# Vivado block design design_1, xczu28dr-ffvg1517-2-e, Vivado 2019.1
# (continued, part 2 of 3)
current_bd_instance /dac_block0_tile1/soft_reset

# ---- hierarchy /dac_block0_tile1/control_switch1 ----
current_bd_instance /dac_block0_tile1/control_switch1
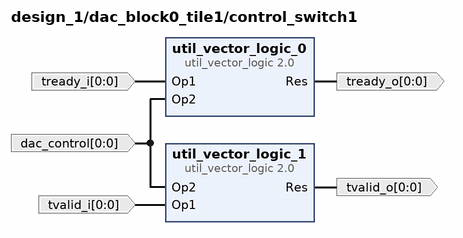
[diagram p18: block diagram inside /dac_block0_tile1/control_switch1]
create_bd_pin -dir I -from 0 -to 0 tready_i
create_bd_pin -dir I -from 0 -to 0 tvalid_i
create_bd_pin -dir O -from 0 -to 0 tready_o
create_bd_pin -dir O -from 0 -to 0 tvalid_o
create_bd_pin -dir I -from 0 -to 0 dac_control

create_bd_cell -type ip -vlnv xilinx.com:ip:util_vector_logic:2.0 util_vector_logic_0
set_property -dict {CONFIG.C_SIZE 1} [get_bd_cells util_vector_logic_0]
create_bd_cell -type ip -vlnv xilinx.com:ip:util_vector_logic:2.0 util_vector_logic_1
set_property -dict {CONFIG.C_SIZE 1} [get_bd_cells util_vector_logic_1]

# ---- hierarchy /dac_block0_tile1/control_localstart ----
current_bd_instance /dac_block0_tile1/control_localstart
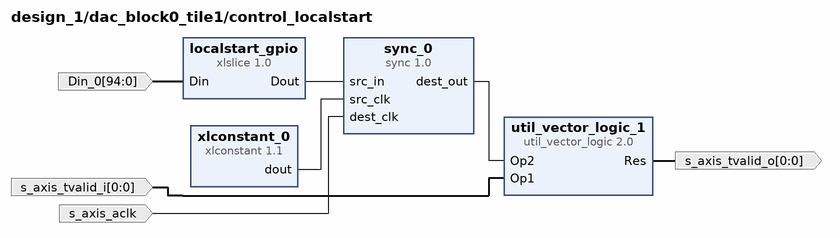
[diagram p19: block diagram inside /dac_block0_tile1/control_localstart]
create_bd_pin -dir I -from 0 -to 0 s_axis_tvalid_i
create_bd_pin -dir O -from 0 -to 0 s_axis_tvalid_o
create_bd_pin -dir I -from 94 -to 0 Din_0
create_bd_pin -dir I -type clk s_axis_aclk

create_bd_cell -type ip -vlnv xilinx.com:ip:util_vector_logic:2.0 util_vector_logic_1
set_property -dict {CONFIG.C_SIZE 1} [get_bd_cells util_vector_logic_1]
create_bd_cell -type ip -vlnv xilinx.com:ip:xlslice:1.0 localstart_gpio
set_property -dict {CONFIG.DIN_FROM 20 CONFIG.DIN_TO 20 CONFIG.DIN_WIDTH 95 CONFIG.DOUT_WIDTH 1} [get_bd_cells localstart_gpio]
create_bd_cell -type ip -vlnv xilinx.com:user:sync:1.0 sync_0
set_property -dict {CONFIG.DEST_SYNC_FF 2 CONFIG.SRC_INPUT_REG 0} [get_bd_cells sync_0]
create_bd_cell -type ip -vlnv xilinx.com:ip:xlconstant:1.1 xlconstant_0
set_property -dict {CONFIG.CONST_VAL 0} [get_bd_cells xlconstant_0]

# ---- hierarchy /ch_div_block ----
current_bd_instance /ch_div_block
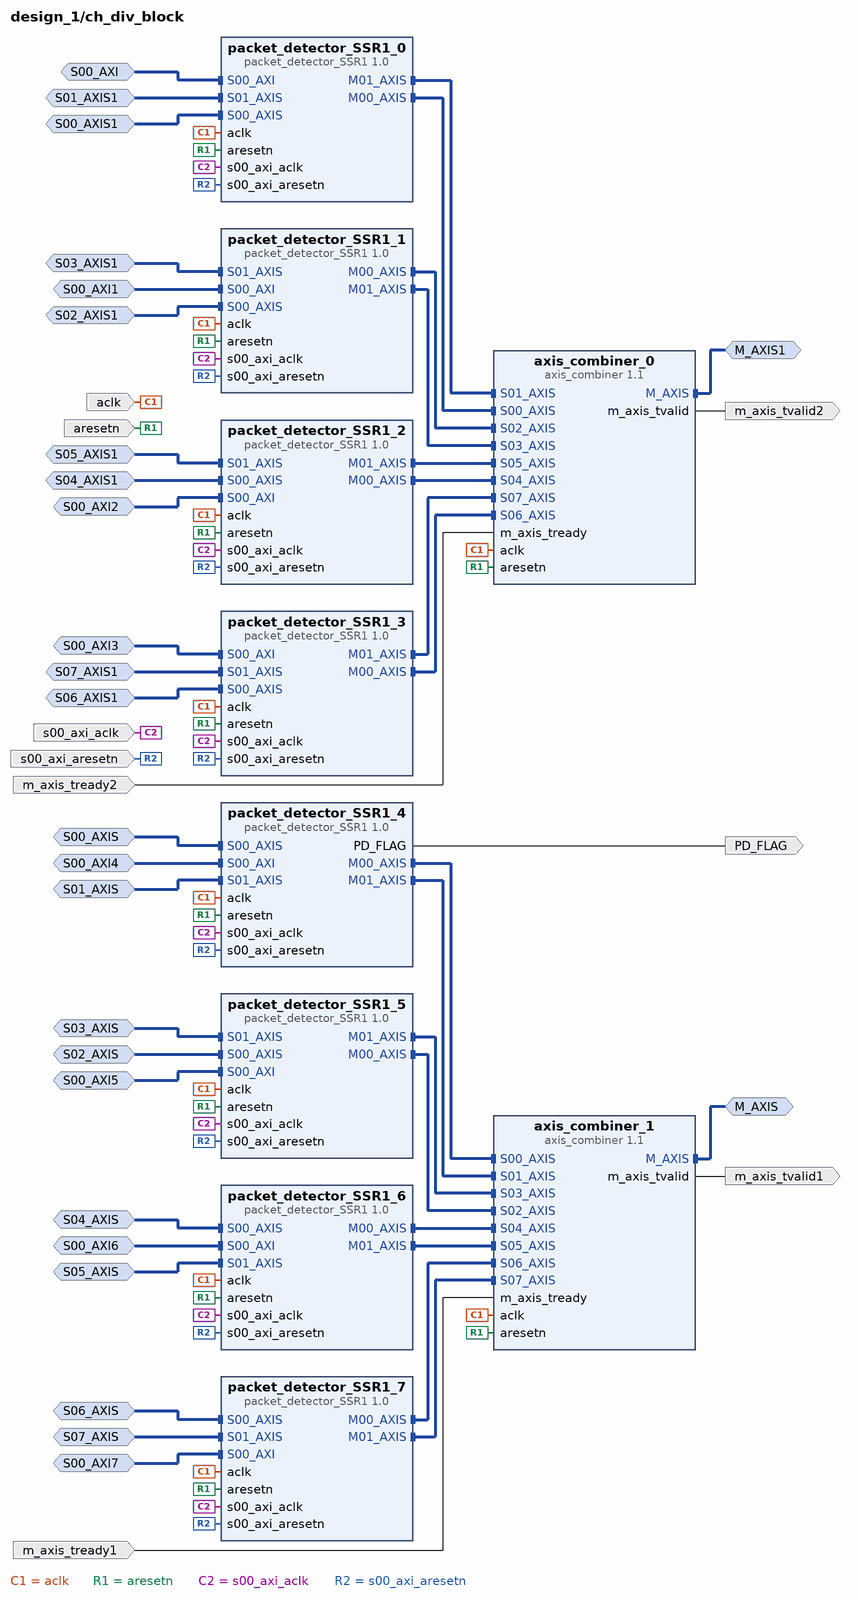
[diagram p20: block diagram inside /ch_div_block]
create_bd_intf_pin -mode Master -vlnv xilinx.com:interface:axis_rtl:1.0 M_AXIS
create_bd_intf_pin -mode Master -vlnv xilinx.com:interface:axis_rtl:1.0 M_AXIS1
create_bd_intf_pin -mode Slave -vlnv xilinx.com:interface:axis_rtl:1.0 S00_AXIS
create_bd_intf_pin -mode Slave -vlnv xilinx.com:interface:axis_rtl:1.0 S01_AXIS
create_bd_intf_pin -mode Slave -vlnv xilinx.com:interface:axis_rtl:1.0 S02_AXIS
create_bd_intf_pin -mode Slave -vlnv xilinx.com:interface:axis_rtl:1.0 S03_AXIS
create_bd_intf_pin -mode Slave -vlnv xilinx.com:interface:axis_rtl:1.0 S04_AXIS
create_bd_intf_pin -mode Slave -vlnv xilinx.com:interface:axis_rtl:1.0 S05_AXIS
create_bd_intf_pin -mode Slave -vlnv xilinx.com:interface:axis_rtl:1.0 S06_AXIS
create_bd_intf_pin -mode Slave -vlnv xilinx.com:interface:axis_rtl:1.0 S07_AXIS
create_bd_intf_pin -mode Slave -vlnv xilinx.com:interface:axis_rtl:1.0 S00_AXIS1
create_bd_intf_pin -mode Slave -vlnv xilinx.com:interface:axis_rtl:1.0 S01_AXIS1
create_bd_intf_pin -mode Slave -vlnv xilinx.com:interface:axis_rtl:1.0 S02_AXIS1
create_bd_intf_pin -mode Slave -vlnv xilinx.com:interface:axis_rtl:1.0 S03_AXIS1
create_bd_intf_pin -mode Slave -vlnv xilinx.com:interface:axis_rtl:1.0 S04_AXIS1
create_bd_intf_pin -mode Slave -vlnv xilinx.com:interface:axis_rtl:1.0 S05_AXIS1
create_bd_intf_pin -mode Slave -vlnv xilinx.com:interface:axis_rtl:1.0 S06_AXIS1
create_bd_intf_pin -mode Slave -vlnv xilinx.com:interface:axis_rtl:1.0 S07_AXIS1
create_bd_intf_pin -mode Slave -vlnv xilinx.com:interface:aximm_rtl:1.0 S00_AXI
create_bd_intf_pin -mode Slave -vlnv xilinx.com:interface:aximm_rtl:1.0 S00_AXI1
create_bd_intf_pin -mode Slave -vlnv xilinx.com:interface:aximm_rtl:1.0 S00_AXI2
create_bd_intf_pin -mode Slave -vlnv xilinx.com:interface:aximm_rtl:1.0 S00_AXI3
create_bd_intf_pin -mode Slave -vlnv xilinx.com:interface:aximm_rtl:1.0 S00_AXI4
create_bd_intf_pin -mode Slave -vlnv xilinx.com:interface:aximm_rtl:1.0 S00_AXI5
create_bd_intf_pin -mode Slave -vlnv xilinx.com:interface:aximm_rtl:1.0 S00_AXI6
create_bd_intf_pin -mode Slave -vlnv xilinx.com:interface:aximm_rtl:1.0 S00_AXI7
create_bd_pin -dir I -type clk aclk
create_bd_pin -dir I -type rst aresetn
create_bd_pin -dir O m_axis_tvalid1
create_bd_pin -dir I m_axis_tready1
create_bd_pin -dir O m_axis_tvalid2
create_bd_pin -dir I m_axis_tready2
create_bd_pin -dir I -type clk s00_axi_aclk
create_bd_pin -dir I -type rst s00_axi_aresetn
create_bd_pin -dir O PD_FLAG

create_bd_cell -type ip -vlnv xilinx.com:ip:axis_combiner:1.1 axis_combiner_0
set_property -dict {CONFIG.NUM_SI 8} [get_bd_cells axis_combiner_0]
create_bd_cell -type ip -vlnv xilinx.com:ip:axis_combiner:1.1 axis_combiner_1
set_property -dict {CONFIG.NUM_SI 8} [get_bd_cells axis_combiner_1]
create_bd_cell -type ip -vlnv user.org:user:packet_detector_SSR1:1.0 packet_detector_SSR1_0
create_bd_cell -type ip -vlnv user.org:user:packet_detector_SSR1:1.0 packet_detector_SSR1_1
create_bd_cell -type ip -vlnv user.org:user:packet_detector_SSR1:1.0 packet_detector_SSR1_2
create_bd_cell -type ip -vlnv user.org:user:packet_detector_SSR1:1.0 packet_detector_SSR1_3
create_bd_cell -type ip -vlnv user.org:user:packet_detector_SSR1:1.0 packet_detector_SSR1_4
create_bd_cell -type ip -vlnv user.org:user:packet_detector_SSR1:1.0 packet_detector_SSR1_5
create_bd_cell -type ip -vlnv user.org:user:packet_detector_SSR1:1.0 packet_detector_SSR1_6
create_bd_cell -type ip -vlnv user.org:user:packet_detector_SSR1:1.0 packet_detector_SSR1_7

# ---- hierarchy /data_width_block ----
current_bd_instance /data_width_block
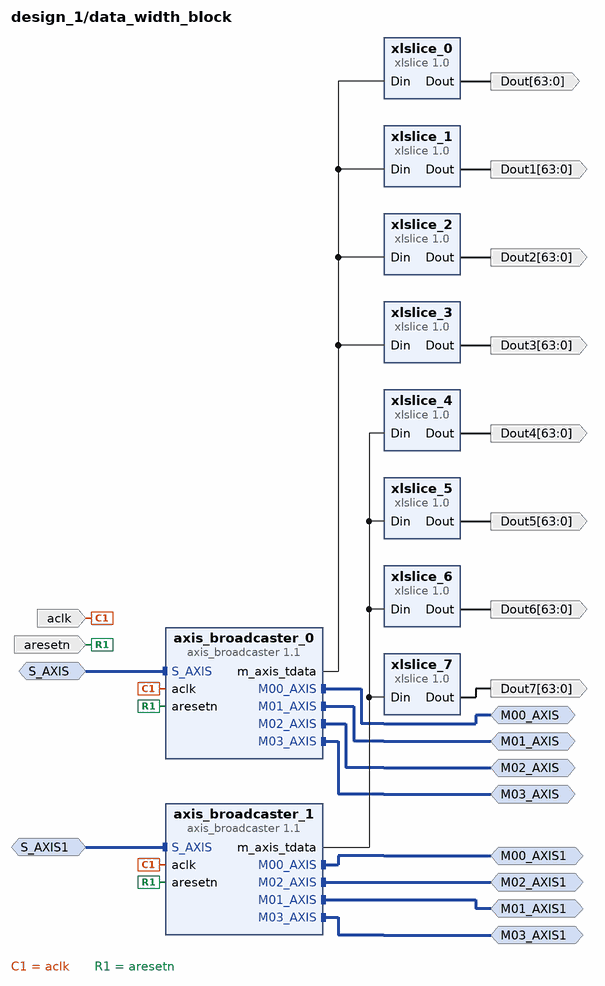
[diagram p21: block diagram inside /data_width_block]
create_bd_intf_pin -mode Slave -vlnv xilinx.com:interface:axis_rtl:1.0 S_AXIS
create_bd_intf_pin -mode Master -vlnv xilinx.com:interface:axis_rtl:1.0 M00_AXIS
create_bd_intf_pin -mode Master -vlnv xilinx.com:interface:axis_rtl:1.0 M01_AXIS
create_bd_intf_pin -mode Master -vlnv xilinx.com:interface:axis_rtl:1.0 M02_AXIS
create_bd_intf_pin -mode Master -vlnv xilinx.com:interface:axis_rtl:1.0 M03_AXIS
create_bd_intf_pin -mode Slave -vlnv xilinx.com:interface:axis_rtl:1.0 S_AXIS1
create_bd_intf_pin -mode Master -vlnv xilinx.com:interface:axis_rtl:1.0 M00_AXIS1
create_bd_intf_pin -mode Master -vlnv xilinx.com:interface:axis_rtl:1.0 M01_AXIS1
create_bd_intf_pin -mode Master -vlnv xilinx.com:interface:axis_rtl:1.0 M02_AXIS1
create_bd_intf_pin -mode Master -vlnv xilinx.com:interface:axis_rtl:1.0 M03_AXIS1
create_bd_pin -dir O -from 63 -to 0 Dout
create_bd_pin -dir O -from 63 -to 0 Dout1
create_bd_pin -dir O -from 63 -to 0 Dout2
create_bd_pin -dir O -from 63 -to 0 Dout3
create_bd_pin -dir I -type clk aclk
create_bd_pin -dir I -type rst aresetn
create_bd_pin -dir O -from 63 -to 0 Dout4
create_bd_pin -dir O -from 63 -to 0 Dout5
create_bd_pin -dir O -from 63 -to 0 Dout6
create_bd_pin -dir O -from 63 -to 0 Dout7

create_bd_cell -type ip -vlnv xilinx.com:ip:xlslice:1.0 xlslice_0
set_property -dict {CONFIG.DIN_FROM 255 CONFIG.DIN_TO 192 CONFIG.DIN_WIDTH 256 CONFIG.DOUT_WIDTH 1} [get_bd_cells xlslice_0]
create_bd_cell -type ip -vlnv xilinx.com:ip:xlslice:1.0 xlslice_1
set_property -dict {CONFIG.DIN_FROM 191 CONFIG.DIN_TO 128 CONFIG.DIN_WIDTH 256 CONFIG.DOUT_WIDTH 64} [get_bd_cells xlslice_1]
create_bd_cell -type ip -vlnv xilinx.com:ip:xlslice:1.0 xlslice_2
set_property -dict {CONFIG.DIN_FROM 63 CONFIG.DIN_TO 0 CONFIG.DIN_WIDTH 256 CONFIG.DOUT_WIDTH 1} [get_bd_cells xlslice_2]
create_bd_cell -type ip -vlnv xilinx.com:ip:xlslice:1.0 xlslice_3
set_property -dict {CONFIG.DIN_FROM 127 CONFIG.DIN_TO 64 CONFIG.DIN_WIDTH 256 CONFIG.DOUT_WIDTH 64} [get_bd_cells xlslice_3]
create_bd_cell -type ip -vlnv xilinx.com:ip:axis_broadcaster:1.1 axis_broadcaster_0
set_property -dict [list \
  CONFIG.HAS_TKEEP 1 \
  CONFIG.M02_TDATA_REMAP {tdata[255:0]} \
  CONFIG.M03_TDATA_REMAP {tdata[255:0]} \
  CONFIG.NUM_MI 4 \
] [get_bd_cells axis_broadcaster_0]
create_bd_cell -type ip -vlnv xilinx.com:ip:axis_broadcaster:1.1 axis_broadcaster_1
set_property -dict [list \
  CONFIG.M02_TDATA_REMAP {tdata[255:0]} \
  CONFIG.M03_TDATA_REMAP {tdata[255:0]} \
  CONFIG.NUM_MI 4 \
] [get_bd_cells axis_broadcaster_1]
create_bd_cell -type ip -vlnv xilinx.com:ip:xlslice:1.0 xlslice_4
set_property -dict {CONFIG.DIN_FROM 255 CONFIG.DIN_TO 192 CONFIG.DIN_WIDTH 256 CONFIG.DOUT_WIDTH 1} [get_bd_cells xlslice_4]
create_bd_cell -type ip -vlnv xilinx.com:ip:xlslice:1.0 xlslice_5
set_property -dict {CONFIG.DIN_FROM 191 CONFIG.DIN_TO 128 CONFIG.DIN_WIDTH 256 CONFIG.DOUT_WIDTH 1} [get_bd_cells xlslice_5]
create_bd_cell -type ip -vlnv xilinx.com:ip:xlslice:1.0 xlslice_6
set_property -dict {CONFIG.DIN_FROM 127 CONFIG.DIN_TO 64 CONFIG.DIN_WIDTH 256 CONFIG.DOUT_WIDTH 1} [get_bd_cells xlslice_6]
create_bd_cell -type ip -vlnv xilinx.com:ip:xlslice:1.0 xlslice_7
set_property -dict {CONFIG.DIN_FROM 63 CONFIG.DIN_TO 0 CONFIG.DIN_WIDTH 256 CONFIG.DOUT_WIDTH 1} [get_bd_cells xlslice_7]

# ---- connections ----

current_bd_instance /MTS_Block
connect_bd_intf_net [get_bd_intf_pins CLK_DIFF_SYSREF_CLK] [get_bd_intf_pins util_ds_buf_1/CLK_IN_D]
connect_bd_intf_net [get_bd_intf_pins CLK_DIFF_PL_CLK] [get_bd_intf_pins util_ds_buf_0/CLK_IN_D]
connect_bd_net [get_bd_pins util_ds_buf_0/IBUF_OUT] [get_bd_pins clk_wiz_0/clk_in1] [get_bd_pins sync_0/dest_clk]
connect_bd_net [get_bd_pins sync_0/dest_out] [get_bd_pins sync_1/src_in] [get_bd_pins sync_2/src_in]
connect_bd_net [get_bd_pins sync_1/dest_out] [get_bd_pins user_sysref_dac]
connect_bd_net [get_bd_pins xlconstant_0/dout] [get_bd_pins sync_0/src_clk] [get_bd_pins sync_1/src_clk] [get_bd_pins sync_2/src_clk]
connect_bd_net [get_bd_pins util_ds_buf_1/IBUF_OUT] [get_bd_pins sync_0/src_in]
connect_bd_net [get_bd_pins sync_2/dest_out] [get_bd_pins user_sysref_adc]
connect_bd_net [get_bd_pins clk_wiz_0/clk_out3] [get_bd_pins adc45_clk] [get_bd_pins sync_2/dest_clk]
connect_bd_net [get_bd_pins clk_wiz_0/clk_out1] [get_bd_pins dac45_clk] [get_bd_pins sync_1/dest_clk]
connect_bd_net [get_bd_pins clk_wiz_0/clk_out2] [get_bd_pins dac_clk]
connect_bd_net [get_bd_pins clk_wiz_0/clk_out4] [get_bd_pins adc_clk]

current_bd_instance /reset_block
connect_bd_net -net zynq_ultra_ps_e_0_pl_clk0 [get_bd_pins slowest_sync_clk] [get_bd_pins rst_ps8_0_96M/slowest_sync_clk]
connect_bd_net -net zynq_ultra_ps_e_0_pl_resetn0 [get_bd_pins ext_reset_in] \
  [get_bd_pins rst_ps8_0_96M1/ext_reset_in] [get_bd_pins rst_ps8_0_96M/ext_reset_in] \
  [get_bd_pins rst_ps8_0_96M2/ext_reset_in]
connect_bd_net [get_bd_pins rst_ps8_0_96M/peripheral_aresetn] [get_bd_pins peripheral_aresetn]
connect_bd_net -net MTS_Block_dac_clk [get_bd_pins slowest_sync_clk1] [get_bd_pins rst_ps8_0_96M1/slowest_sync_clk]
connect_bd_net [get_bd_pins rst_ps8_0_96M1/peripheral_aresetn] [get_bd_pins peripheral_aresetn1]
connect_bd_net [get_bd_pins rst_ddr4_0_333M/peripheral_aresetn] [get_bd_pins peripheral_aresetn2]
connect_bd_net -net slowest_sync_clk2_1 [get_bd_pins slowest_sync_clk2] [get_bd_pins rst_ddr4_0_333M/slowest_sync_clk]
connect_bd_net -net ext_reset_in1_1 [get_bd_pins ext_reset_in1] [get_bd_pins rst_ddr4_0_333M/ext_reset_in]
connect_bd_net [get_bd_pins rst_ps8_0_96M2/peripheral_aresetn] [get_bd_pins peripheral_aresetn3]
connect_bd_net -net slowest_sync_clk3_1 [get_bd_pins slowest_sync_clk3] [get_bd_pins rst_ps8_0_96M2/slowest_sync_clk]

current_bd_instance /dac_dma_block
connect_bd_intf_net [get_bd_intf_pins axis_register_slice_0/S_AXIS] [get_bd_intf_pins axi_dma_0/M_AXIS_MM2S]
connect_bd_intf_net [get_bd_intf_pins M00_AXIS] [get_bd_intf_pins axis_broadcaster_0/M00_AXIS]
connect_bd_intf_net [get_bd_intf_pins S_AXI_LITE] [get_bd_intf_pins axi_dma_0/S_AXI_LITE]
connect_bd_intf_net [get_bd_intf_pins axis_register_slice_0/M_AXIS] [get_bd_intf_pins axis_broadcaster_0/S_AXIS]
connect_bd_intf_net [get_bd_intf_pins M_AXI_MM2S] [get_bd_intf_pins axi_register_slice_0/M_AXI]
connect_bd_intf_net [get_bd_intf_pins M01_AXIS] [get_bd_intf_pins axis_broadcaster_0/M01_AXIS]
connect_bd_intf_net [get_bd_intf_pins axi_register_slice_0/S_AXI] [get_bd_intf_pins axi_dma_0/M_AXI_MM2S]
connect_bd_net -net zynq_ultra_ps_e_0_pl_clk0 [get_bd_pins s_axi_lite_aclk] [get_bd_pins axi_dma_0/s_axi_lite_aclk]
connect_bd_net -net rst_ps8_0_96M_peripheral_aresetn [get_bd_pins axi_resetn] [get_bd_pins axi_dma_0/axi_resetn]
connect_bd_net -net ddr4_0_c0_ddr4_ui_clk [get_bd_pins m_axi_mm2s_aclk] \
  [get_bd_pins axi_dma_0/m_axi_mm2s_aclk] [get_bd_pins axis_broadcaster_0/aclk] [get_bd_pins axi_register_slice_0/aclk] \
  [get_bd_pins axis_register_slice_0/aclk]
connect_bd_net [get_bd_pins aresetn_300Mhz] \
  [get_bd_pins axis_broadcaster_0/aresetn] [get_bd_pins axis_register_slice_0/aresetn] \
  [get_bd_pins axi_register_slice_0/aresetn]

current_bd_instance /ddr_block
connect_bd_intf_net [get_bd_intf_pins user_si570_sysclk] [get_bd_intf_pins ddr4_0/C0_SYS_CLK]
connect_bd_intf_net [get_bd_intf_pins ddr4_sdram] [get_bd_intf_pins ddr4_0/C0_DDR4]
connect_bd_intf_net [get_bd_intf_pins axi_register_slice_3/M_AXI] [get_bd_intf_pins smartconnect_0/S02_AXI]
connect_bd_intf_net [get_bd_intf_pins HPM0_AXI] [get_bd_intf_pins axi_register_slice_2/S_AXI]
connect_bd_intf_net [get_bd_intf_pins S00_AXI] [get_bd_intf_pins axi_register_slice_1/S_AXI]
connect_bd_intf_net [get_bd_intf_pins smartconnect_0/M00_AXI] [get_bd_intf_pins axi_register_slice_0/S_AXI]
connect_bd_intf_net [get_bd_intf_pins S_AXI] [get_bd_intf_pins axi_register_slice_3/S_AXI]
connect_bd_intf_net [get_bd_intf_pins axi_register_slice_0/M_AXI] [get_bd_intf_pins ddr4_0/C0_DDR4_S_AXI]
connect_bd_intf_net [get_bd_intf_pins axi_register_slice_1/M_AXI] [get_bd_intf_pins smartconnect_0/S00_AXI]
connect_bd_intf_net [get_bd_intf_pins axi_register_slice_2/M_AXI] [get_bd_intf_pins smartconnect_0/S01_AXI]
connect_bd_net [get_bd_pins ddr4_0/c0_ddr4_ui_clk] \
  [get_bd_pins c0_ddr4_ui_clk] [get_bd_pins smartconnect_0/aclk] [get_bd_pins axi_register_slice_0/aclk] \
  [get_bd_pins axi_register_slice_1/aclk] [get_bd_pins axi_register_slice_2/aclk] [get_bd_pins axi_register_slice_3/aclk]
connect_bd_net -net rst_ddr4_0_333M_peripheral_aresetn [get_bd_pins ARESETN] \
  [get_bd_pins ddr4_0/c0_ddr4_aresetn] [get_bd_pins smartconnect_0/aresetn] [get_bd_pins axi_register_slice_0/aresetn] \
  [get_bd_pins axi_register_slice_1/aresetn] [get_bd_pins axi_register_slice_2/aresetn] \
  [get_bd_pins axi_register_slice_3/aresetn]
connect_bd_net [get_bd_pins ddr4_0/c0_ddr4_ui_clk_sync_rst] [get_bd_pins c0_ddr4_ui_clk_sync_rst]
connect_bd_net [get_bd_pins reset] [get_bd_pins ddr4_0/sys_rst]

current_bd_instance /control_block
connect_bd_net -net Din_0_1 [get_bd_pins Din_0] [get_bd_pins globalstart_gpio_dac/Din] [get_bd_pins globalstart_gpio_adc/Din]
connect_bd_net -net xlslice_0_Dout [get_bd_pins globalstart_gpio_dac/Dout] [get_bd_pins sync_0/src_in]
connect_bd_net [get_bd_pins xlconstant_0/dout] [get_bd_pins sync_0/src_clk] [get_bd_pins sync_1/src_clk]
connect_bd_net -net dest_clk_0_1 [get_bd_pins dac_clk] [get_bd_pins sync_0/dest_clk]
connect_bd_net [get_bd_pins sync_0/dest_out] [get_bd_pins dac_control]
connect_bd_net [get_bd_pins sync_1/dest_out] [get_bd_pins adc_control]
connect_bd_net -net dest_clk_1 [get_bd_pins adc_clk] [get_bd_pins sync_1/dest_clk]
connect_bd_net [get_bd_pins globalstart_gpio_adc/Dout] [get_bd_pins sync_1/src_in]

current_bd_instance /adc_tile0
connect_bd_intf_net [get_bd_intf_pins S01_AXIS] [get_bd_intf_pins packet_counter_0/S01_AXIS]
connect_bd_intf_net [get_bd_intf_pins axis_dwidth_converter_0/M_AXIS] [get_bd_intf_pins axis_register_slice_0/S_AXIS]
connect_bd_intf_net [get_bd_intf_pins axis_register_slice_1/S_AXIS] [get_bd_intf_pins axis_dwidth_converter_1/M_AXIS]
connect_bd_intf_net [get_bd_intf_pins S00_AXIS] [get_bd_intf_pins packet_counter_0/S00_AXIS]
connect_bd_intf_net [get_bd_intf_pins axis_register_slice_0/M_AXIS] [get_bd_intf_pins axis_data_fifo_1/S_AXIS]
connect_bd_intf_net [get_bd_intf_pins SLOT_0_AXIS] [get_bd_intf_pins axis_combiner_0/M_AXIS]
connect_bd_intf_net [get_bd_intf_pins axis_data_fifo_1/M_AXIS] [get_bd_intf_pins axis_combiner_0/S01_AXIS]
connect_bd_intf_net [get_bd_intf_pins S00_AXI] [get_bd_intf_pins packet_counter_0/S00_AXI]
connect_bd_intf_net [get_bd_intf_pins axis_data_fifo_0/M_AXIS] [get_bd_intf_pins axis_combiner_0/S00_AXIS]
connect_bd_intf_net [get_bd_intf_pins packet_counter_0/M01_AXIS] [get_bd_intf_pins axis_dwidth_converter_0/S_AXIS]
connect_bd_intf_net [get_bd_intf_pins packet_counter_0/M00_AXIS] [get_bd_intf_pins axis_dwidth_converter_1/S_AXIS]
connect_bd_intf_net [get_bd_intf_pins axis_register_slice_1/M_AXIS] [get_bd_intf_pins axis_data_fifo_0/S_AXIS]
connect_bd_net -net MTS_Block_dac_clk [get_bd_pins adc_clk] \
  [get_bd_pins soft_reset/adc_clk] [get_bd_pins axis_data_fifo_0/s_axis_aclk] [get_bd_pins axis_dwidth_converter_1/aclk] \
  [get_bd_pins axis_dwidth_converter_0/aclk] [get_bd_pins axis_data_fifo_1/s_axis_aclk] \
  [get_bd_pins axis_register_slice_0/aclk] [get_bd_pins axis_register_slice_1/aclk] [get_bd_pins packet_counter_0/aclk]
connect_bd_net -net Din_0_1 [get_bd_pins Din_0] [get_bd_pins soft_reset/Din_0]
connect_bd_net [get_bd_pins axi_resetn] [get_bd_pins soft_reset/axi_resetn]
connect_bd_net [get_bd_pins adc_clk_aresetn] [get_bd_pins soft_reset/adc_clk_aresetn]
connect_bd_net [get_bd_pins soft_reset/dac_clk_soft_aresetn] \
  [get_bd_pins axis_data_fifo_0/s_axis_aresetn] [get_bd_pins axis_dwidth_converter_1/aresetn] \
  [get_bd_pins axis_dwidth_converter_0/aresetn] [get_bd_pins axis_data_fifo_1/s_axis_aresetn] \
  [get_bd_pins axis_register_slice_0/aresetn] [get_bd_pins axis_register_slice_1/aresetn] \
  [get_bd_pins packet_counter_0/aresetn]
connect_bd_net -net dac_control_1 [get_bd_pins adc_control] [get_bd_pins control_switch1/dac_control] [get_bd_pins control_switch0/dac_control]
connect_bd_net [get_bd_pins soft_reset/axi_soft_resetn] [get_bd_pins axis_combiner_0/aresetn] [get_bd_pins axi_soft_resetn]
connect_bd_net -net ddr4_0_c0_ddr4_ui_clk [get_bd_pins s_axis_aclk] \
  [get_bd_pins soft_reset/s_axis_aclk_300] [get_bd_pins axis_data_fifo_0/m_axis_aclk] \
  [get_bd_pins axis_data_fifo_1/m_axis_aclk] [get_bd_pins axis_combiner_0/aclk]
connect_bd_net -net control_switch2_tready_o [get_bd_pins control_switch0/tready_o] [get_bd_pins tready_o]
connect_bd_net [get_bd_pins tvalid_i] [get_bd_pins control_switch0/tvalid_i]
connect_bd_net -net control_switch3_tready_o [get_bd_pins control_switch1/tready_o] [get_bd_pins tready_o1]
connect_bd_net [get_bd_pins tvalid_i1] [get_bd_pins control_switch1/tvalid_i]
connect_bd_net [get_bd_pins axis_data_fifo_0/axis_wr_data_count] [get_bd_pins axis_wr_data_count]
connect_bd_net [get_bd_pins axis_data_fifo_1/axis_wr_data_count] [get_bd_pins axis_wr_data_count1]
connect_bd_net -net tready_i_1 [get_bd_pins axis_dwidth_converter_0/s_axis_tready] [get_bd_pins control_switch0/tready_i]
connect_bd_net [get_bd_pins control_switch0/tvalid_o] [get_bd_pins axis_dwidth_converter_0/s_axis_tvalid]
connect_bd_net -net tready_i_2 [get_bd_pins axis_dwidth_converter_1/s_axis_tready] [get_bd_pins control_switch1/tready_i]
connect_bd_net [get_bd_pins control_switch1/tvalid_o] [get_bd_pins axis_dwidth_converter_1/s_axis_tvalid]
connect_bd_net [get_bd_pins s00_axi_aclk] [get_bd_pins packet_counter_0/s00_axi_aclk]
connect_bd_net [get_bd_pins s00_axi_aresetn] [get_bd_pins packet_counter_0/s00_axi_aresetn]
connect_bd_net [get_bd_pins PD_FLAG] [get_bd_pins packet_counter_0/PD_FLAG]

current_bd_instance /adc_tile0/soft_reset
connect_bd_net [get_bd_pins xlslice_0/Dout] [get_bd_pins util_vector_logic_2/Op1]
connect_bd_net [get_bd_pins util_vector_logic_2/Res] [get_bd_pins sync_1/src_in] [get_bd_pins sync_0/src_in]
connect_bd_net [get_bd_pins xlconstant_0/dout] [get_bd_pins sync_1/src_clk] [get_bd_pins sync_0/src_clk]
connect_bd_net -net Din_1_1 [get_bd_pins Din_0] [get_bd_pins xlslice_0/Din]
connect_bd_net -net dest_clk_0_1 [get_bd_pins adc_clk] [get_bd_pins sync_0/dest_clk]
connect_bd_net -net dest_clk_1_1 [get_bd_pins s_axis_aclk_300] [get_bd_pins sync_1/dest_clk]
connect_bd_net [get_bd_pins sync_0/dest_out] [get_bd_pins util_vector_logic_0/Op2]
connect_bd_net -net dac_clk_aresetn_1 [get_bd_pins adc_clk_aresetn] [get_bd_pins util_vector_logic_0/Op1]
connect_bd_net [get_bd_pins axi_resetn] [get_bd_pins util_vector_logic_1/Op2]
connect_bd_net [get_bd_pins sync_1/dest_out] [get_bd_pins util_vector_logic_1/Op1]
connect_bd_net [get_bd_pins util_vector_logic_0/Res] [get_bd_pins dac_clk_soft_aresetn]
connect_bd_net [get_bd_pins util_vector_logic_1/Res] [get_bd_pins axi_soft_resetn]

current_bd_instance /adc_tile0/control_switch0
connect_bd_net -net Op1_0_1 [get_bd_pins tready_i] [get_bd_pins util_vector_logic_0/Op1]
connect_bd_net -net Op1_1_1 [get_bd_pins tvalid_i] [get_bd_pins util_vector_logic_1/Op1]
connect_bd_net [get_bd_pins util_vector_logic_0/Res] [get_bd_pins tready_o]
connect_bd_net [get_bd_pins util_vector_logic_1/Res] [get_bd_pins tvalid_o]
connect_bd_net -net util_vector_logic_2_Res [get_bd_pins dac_control] [get_bd_pins util_vector_logic_0/Op2] [get_bd_pins util_vector_logic_1/Op2]

current_bd_instance /adc_tile0/control_switch1
connect_bd_net -net Op1_0_1 [get_bd_pins tready_i] [get_bd_pins util_vector_logic_0/Op1]
connect_bd_net -net Op1_1_1 [get_bd_pins tvalid_i] [get_bd_pins util_vector_logic_1/Op1]
connect_bd_net [get_bd_pins util_vector_logic_0/Res] [get_bd_pins tready_o]
connect_bd_net [get_bd_pins util_vector_logic_1/Res] [get_bd_pins tvalid_o]
connect_bd_net -net util_vector_logic_2_Res [get_bd_pins dac_control] [get_bd_pins util_vector_logic_0/Op2] [get_bd_pins util_vector_logic_1/Op2]

current_bd_instance /dac_block1_tile1
connect_bd_intf_net [get_bd_intf_pins axis_data_fifo_0/M_AXIS] [get_bd_intf_pins adc_strm_mux_0/s0_axi_stream]
connect_bd_intf_net [get_bd_intf_pins axis_register_slice_0/M_AXIS] [get_bd_intf_pins axis_data_fifo_2/S_AXIS]
connect_bd_intf_net [get_bd_intf_pins axis_data_fifo_2/M_AXIS] [get_bd_intf_pins axis_broadcaster_0/S_AXIS]
connect_bd_intf_net [get_bd_intf_pins adc_strm_mux_0/m0_axi_stream] [get_bd_intf_pins axis_register_slice_0/S_AXIS]
connect_bd_intf_net [get_bd_intf_pins S_AXIS] [get_bd_intf_pins axis_data_fifo_0/S_AXIS]
connect_bd_intf_net [get_bd_intf_pins S00_AXI] [get_bd_intf_pins idle_packet_0/S00_AXI]
connect_bd_intf_net [get_bd_intf_pins axis_data_fifo_1/M_AXIS] [get_bd_intf_pins adc_strm_mux_0/s1_axi_stream]
connect_bd_intf_net [get_bd_intf_pins SLOT_0_AXIS] [get_bd_intf_pins idle_packet_0/M00_AXIS]
connect_bd_intf_net [get_bd_intf_pins axis_broadcaster_0/M00_AXIS] [get_bd_intf_pins idle_packet_0/S00_AXIS]
connect_bd_intf_net [get_bd_intf_pins axis_data_fifo_1/S_AXIS] [get_bd_intf_pins axis_broadcaster_0/M01_AXIS]
connect_bd_net -net ddr4_0_c0_ddr4_ui_clk [get_bd_pins s_axis_aclk] \
  [get_bd_pins axis_data_fifo_0/s_axis_aclk] [get_bd_pins soft_reset/s_axis_aclk_300] \
  [get_bd_pins control_localstart/s_axis_aclk]
connect_bd_net -net MTS_Block_dac_clk [get_bd_pins s_axis_aclk1] \
  [get_bd_pins axis_data_fifo_2/s_axis_aclk] [get_bd_pins adc_strm_mux_0/s_axis_aclk] \
  [get_bd_pins axis_data_fifo_1/s_axis_aclk] [get_bd_pins axis_data_fifo_0/m_axis_aclk] \
  [get_bd_pins axis_register_slice_0/aclk] [get_bd_pins soft_reset/dac_clk] [get_bd_pins axis_broadcaster_0/aclk] \
  [get_bd_pins idle_packet_0/aclk]
connect_bd_net -net Din_0_1 [get_bd_pins Din_0] [get_bd_pins soft_reset/Din_0] [get_bd_pins loopback_gpio/Din] [get_bd_pins control_localstart/Din_0]
connect_bd_net [get_bd_pins axi_resetn] [get_bd_pins soft_reset/axi_resetn]
connect_bd_net [get_bd_pins dac_clk_aresetn] [get_bd_pins soft_reset/dac_clk_aresetn]
connect_bd_net -net xlslice_0_Dout [get_bd_pins loopback_gpio/Dout] [get_bd_pins adc_strm_mux_0/mux_select]
connect_bd_net [get_bd_pins soft_reset/dac_clk_soft_aresetn] \
  [get_bd_pins axis_data_fifo_1/s_axis_aresetn] [get_bd_pins axis_register_slice_0/aresetn] \
  [get_bd_pins axis_data_fifo_2/s_axis_aresetn] [get_bd_pins axis_broadcaster_0/aresetn] [get_bd_pins idle_packet_0/aresetn]
connect_bd_net [get_bd_pins soft_reset/axi_soft_resetn] [get_bd_pins axis_data_fifo_0/s_axis_aresetn]
connect_bd_net [get_bd_pins control_switch1/tready_o] [get_bd_pins axis_data_fifo_2/m_axis_tready]
connect_bd_net [get_bd_pins axis_broadcaster_0/s_axis_tready] [get_bd_pins control_switch1/tready_i]
connect_bd_net [get_bd_pins axis_data_fifo_2/m_axis_tvalid] [get_bd_pins control_switch1/tvalid_i]
connect_bd_net [get_bd_pins control_switch1/tvalid_o] [get_bd_pins axis_broadcaster_0/s_axis_tvalid]
connect_bd_net [get_bd_pins dac_control] [get_bd_pins control_switch1/dac_control]
connect_bd_net -net util_vector_logic_1_Res [get_bd_pins control_localstart/s_axis_tvalid_o] [get_bd_pins axis_data_fifo_0/s_axis_tvalid]
connect_bd_net [get_bd_pins s_axis_tvalid_i] [get_bd_pins control_localstart/s_axis_tvalid_i]
connect_bd_net -net pl_clk0_1 [get_bd_pins pl_clk0] [get_bd_pins idle_packet_0/s00_axi_aclk]
connect_bd_net [get_bd_pins peripheral_aresetn] [get_bd_pins idle_packet_0/s00_axi_aresetn]

current_bd_instance /dac_block1_tile1/soft_reset
connect_bd_net [get_bd_pins xlslice_0/Dout] [get_bd_pins util_vector_logic_2/Op1]
connect_bd_net [get_bd_pins util_vector_logic_2/Res] [get_bd_pins sync_1/src_in] [get_bd_pins sync_0/src_in]
connect_bd_net [get_bd_pins xlconstant_0/dout] [get_bd_pins sync_1/src_clk] [get_bd_pins sync_0/src_clk]
connect_bd_net -net Din_1_1 [get_bd_pins Din_0] [get_bd_pins xlslice_0/Din]
connect_bd_net -net dest_clk_0_1 [get_bd_pins dac_clk] [get_bd_pins sync_0/dest_clk]
connect_bd_net -net dest_clk_1_1 [get_bd_pins s_axis_aclk_300] [get_bd_pins sync_1/dest_clk]
connect_bd_net [get_bd_pins sync_0/dest_out] [get_bd_pins util_vector_logic_0/Op2]
connect_bd_net [get_bd_pins dac_clk_aresetn] [get_bd_pins util_vector_logic_0/Op1]
connect_bd_net [get_bd_pins axi_resetn] [get_bd_pins util_vector_logic_1/Op2]
connect_bd_net [get_bd_pins sync_1/dest_out] [get_bd_pins util_vector_logic_1/Op1]
connect_bd_net [get_bd_pins util_vector_logic_0/Res] [get_bd_pins dac_clk_soft_aresetn]
connect_bd_net [get_bd_pins util_vector_logic_1/Res] [get_bd_pins axi_soft_resetn]

current_bd_instance /dac_block1_tile1/control_switch1
connect_bd_net -net Op1_0_1 [get_bd_pins tready_i] [get_bd_pins util_vector_logic_0/Op1]
connect_bd_net -net Op1_1_1 [get_bd_pins tvalid_i] [get_bd_pins util_vector_logic_1/Op1]
connect_bd_net [get_bd_pins util_vector_logic_0/Res] [get_bd_pins tready_o]
connect_bd_net [get_bd_pins util_vector_logic_1/Res] [get_bd_pins tvalid_o]
connect_bd_net -net util_vector_logic_2_Res [get_bd_pins dac_control] [get_bd_pins util_vector_logic_0/Op2] [get_bd_pins util_vector_logic_1/Op2]

current_bd_instance /dac_block1_tile1/control_localstart
connect_bd_net [get_bd_pins s_axis_tvalid_i] [get_bd_pins util_vector_logic_1/Op1]
connect_bd_net [get_bd_pins util_vector_logic_1/Res] [get_bd_pins s_axis_tvalid_o]
connect_bd_net -net Din_0_1 [get_bd_pins Din_0] [get_bd_pins localstart_gpio/Din]
connect_bd_net [get_bd_pins localstart_gpio/Dout] [get_bd_pins sync_0/src_in]
connect_bd_net [get_bd_pins xlconstant_0/dout] [get_bd_pins sync_0/src_clk]
connect_bd_net [get_bd_pins sync_0/dest_out] [get_bd_pins util_vector_logic_1/Op2]
connect_bd_net [get_bd_pins s_axis_aclk] [get_bd_pins sync_0/dest_clk]

current_bd_instance /dac_block0_tile1
connect_bd_intf_net [get_bd_intf_pins axis_data_fifo_0/M_AXIS] [get_bd_intf_pins adc_strm_mux_0/s0_axi_stream]
connect_bd_intf_net [get_bd_intf_pins axis_data_fifo_2/M_AXIS] [get_bd_intf_pins axis_broadcaster_0/S_AXIS]
connect_bd_intf_net [get_bd_intf_pins adc_strm_mux_0/m0_axi_stream] [get_bd_intf_pins axis_register_slice_0/S_AXIS]
connect_bd_intf_net [get_bd_intf_pins axis_data_fifo_1/M_AXIS] [get_bd_intf_pins adc_strm_mux_0/s1_axi_stream]
connect_bd_intf_net [get_bd_intf_pins SLOT_0_AXIS] [get_bd_intf_pins idle_packet_0/M00_AXIS]
connect_bd_intf_net [get_bd_intf_pins idle_packet_0/S00_AXIS] [get_bd_intf_pins axis_broadcaster_0/M00_AXIS]
connect_bd_intf_net [get_bd_intf_pins axis_data_fifo_1/S_AXIS] [get_bd_intf_pins axis_broadcaster_0/M01_AXIS]
connect_bd_intf_net [get_bd_intf_pins S_AXIS] [get_bd_intf_pins axis_data_fifo_0/S_AXIS]
connect_bd_intf_net [get_bd_intf_pins axis_register_slice_0/M_AXIS] [get_bd_intf_pins axis_data_fifo_2/S_AXIS]
connect_bd_intf_net [get_bd_intf_pins S00_AXI] [get_bd_intf_pins idle_packet_0/S00_AXI]
connect_bd_net -net ddr4_0_c0_ddr4_ui_clk [get_bd_pins s_axis_aclk] \
  [get_bd_pins axis_data_fifo_0/s_axis_aclk] [get_bd_pins soft_reset/s_axis_aclk_300] \
  [get_bd_pins control_localstart/s_axis_aclk]
connect_bd_net -net MTS_Block_dac_clk [get_bd_pins s_axis_aclk1] \
  [get_bd_pins axis_data_fifo_2/s_axis_aclk] [get_bd_pins adc_strm_mux_0/s_axis_aclk] \
  [get_bd_pins axis_data_fifo_1/s_axis_aclk] [get_bd_pins axis_data_fifo_0/m_axis_aclk] \
  [get_bd_pins axis_register_slice_0/aclk] [get_bd_pins soft_reset/dac_clk] [get_bd_pins axis_broadcaster_0/aclk] \
  [get_bd_pins idle_packet_0/aclk]
connect_bd_net -net Din_0_1 [get_bd_pins Din_0] [get_bd_pins soft_reset/Din_0] [get_bd_pins loopback_gpio/Din] [get_bd_pins control_localstart/Din_0]
connect_bd_net [get_bd_pins axi_resetn] [get_bd_pins soft_reset/axi_resetn]
connect_bd_net [get_bd_pins dac_clk_aresetn] [get_bd_pins soft_reset/dac_clk_aresetn]
connect_bd_net -net xlslice_0_Dout [get_bd_pins loopback_gpio/Dout] [get_bd_pins adc_strm_mux_0/mux_select]
connect_bd_net [get_bd_pins soft_reset/dac_clk_soft_aresetn] \
  [get_bd_pins axis_data_fifo_1/s_axis_aresetn] [get_bd_pins axis_register_slice_0/aresetn] \
  [get_bd_pins axis_data_fifo_2/s_axis_aresetn] [get_bd_pins axis_broadcaster_0/aresetn] [get_bd_pins idle_packet_0/aresetn]
connect_bd_net [get_bd_pins soft_reset/axi_soft_resetn] [get_bd_pins axis_data_fifo_0/s_axis_aresetn]
connect_bd_net [get_bd_pins control_switch1/tready_o] [get_bd_pins axis_data_fifo_2/m_axis_tready]
connect_bd_net [get_bd_pins axis_broadcaster_0/s_axis_tready] [get_bd_pins control_switch1/tready_i]
connect_bd_net [get_bd_pins axis_data_fifo_2/m_axis_tvalid] [get_bd_pins control_switch1/tvalid_i]
connect_bd_net [get_bd_pins control_switch1/tvalid_o] [get_bd_pins axis_broadcaster_0/s_axis_tvalid]
connect_bd_net [get_bd_pins dac_control] [get_bd_pins control_switch1/dac_control]
connect_bd_net -net util_vector_logic_1_Res [get_bd_pins control_localstart/s_axis_tvalid_o] [get_bd_pins axis_data_fifo_0/s_axis_tvalid]
connect_bd_net [get_bd_pins s_axis_tvalid_i] [get_bd_pins control_localstart/s_axis_tvalid_i]
connect_bd_net -net pl_clk0_1 [get_bd_pins pl_clk0] [get_bd_pins idle_packet_0/s00_axi_aclk]
connect_bd_net [get_bd_pins peripheral_aresetn] [get_bd_pins idle_packet_0/s00_axi_aresetn]

current_bd_instance /dac_block0_tile1/soft_reset
connect_bd_net [get_bd_pins xlslice_0/Dout] [get_bd_pins util_vector_logic_2/Op1]
connect_bd_net [get_bd_pins util_vector_logic_2/Res] [get_bd_pins sync_1/src_in] [get_bd_pins sync_0/src_in]
connect_bd_net [get_bd_pins xlconstant_0/dout] [get_bd_pins sync_1/src_clk] [get_bd_pins sync_0/src_clk]
connect_bd_net -net Din_1_1 [get_bd_pins Din_0] [get_bd_pins xlslice_0/Din]
connect_bd_net -net dest_clk_0_1 [get_bd_pins dac_clk] [get_bd_pins sync_0/dest_clk]
connect_bd_net -net dest_clk_1_1 [get_bd_pins s_axis_aclk_300] [get_bd_pins sync_1/dest_clk]
connect_bd_net [get_bd_pins sync_0/dest_out] [get_bd_pins util_vector_logic_0/Op2]
connect_bd_net [get_bd_pins dac_clk_aresetn] [get_bd_pins util_vector_logic_0/Op1]
connect_bd_net [get_bd_pins axi_resetn] [get_bd_pins util_vector_logic_1/Op2]
connect_bd_net [get_bd_pins sync_1/dest_out] [get_bd_pins util_vector_logic_1/Op1]
connect_bd_net [get_bd_pins util_vector_logic_0/Res] [get_bd_pins dac_clk_soft_aresetn]
connect_bd_net [get_bd_pins util_vector_logic_1/Res] [get_bd_pins axi_soft_resetn]

current_bd_instance /dac_block0_tile1/control_switch1
connect_bd_net -net Op1_0_1 [get_bd_pins tready_i] [get_bd_pins util_vector_logic_0/Op1]
connect_bd_net -net Op1_1_1 [get_bd_pins tvalid_i] [get_bd_pins util_vector_logic_1/Op1]
connect_bd_net [get_bd_pins util_vector_logic_0/Res] [get_bd_pins tready_o]
connect_bd_net [get_bd_pins util_vector_logic_1/Res] [get_bd_pins tvalid_o]
connect_bd_net -net util_vector_logic_2_Res [get_bd_pins dac_control] [get_bd_pins util_vector_logic_0/Op2] [get_bd_pins util_vector_logic_1/Op2]

current_bd_instance /dac_block0_tile1/control_localstart
connect_bd_net [get_bd_pins s_axis_tvalid_i] [get_bd_pins util_vector_logic_1/Op1]
connect_bd_net [get_bd_pins util_vector_logic_1/Res] [get_bd_pins s_axis_tvalid_o]
connect_bd_net -net Din_0_1 [get_bd_pins Din_0] [get_bd_pins localstart_gpio/Din]
connect_bd_net [get_bd_pins localstart_gpio/Dout] [get_bd_pins sync_0/src_in]
connect_bd_net [get_bd_pins xlconstant_0/dout] [get_bd_pins sync_0/src_clk]
connect_bd_net [get_bd_pins sync_0/dest_out] [get_bd_pins util_vector_logic_1/Op2]
connect_bd_net [get_bd_pins s_axis_aclk] [get_bd_pins sync_0/dest_clk]

current_bd_instance /ch_div_block
connect_bd_intf_net [get_bd_intf_pins packet_detector_SSR1_1/M00_AXIS] [get_bd_intf_pins axis_combiner_0/S02_AXIS]
connect_bd_intf_net [get_bd_intf_pins packet_detector_SSR1_6/M00_AXIS] [get_bd_intf_pins axis_combiner_1/S04_AXIS]
connect_bd_intf_net [get_bd_intf_pins S06_AXIS] [get_bd_intf_pins packet_detector_SSR1_7/S00_AXIS]
connect_bd_intf_net [get_bd_intf_pins S03_AXIS] [get_bd_intf_pins packet_detector_SSR1_5/S01_AXIS]
connect_bd_intf_net [get_bd_intf_pins packet_detector_SSR1_0/M01_AXIS] [get_bd_intf_pins axis_combiner_0/S01_AXIS]
connect_bd_intf_net [get_bd_intf_pins S00_AXI3] [get_bd_intf_pins packet_detector_SSR1_3/S00_AXI]
connect_bd_intf_net [get_bd_intf_pins S02_AXIS] [get_bd_intf_pins packet_detector_SSR1_5/S00_AXIS]
connect_bd_intf_net [get_bd_intf_pins packet_detector_SSR1_6/M01_AXIS] [get_bd_intf_pins axis_combiner_1/S05_AXIS]
connect_bd_intf_net [get_bd_intf_pins S00_AXI] [get_bd_intf_pins packet_detector_SSR1_0/S00_AXI]
connect_bd_intf_net [get_bd_intf_pins S05_AXIS1] [get_bd_intf_pins packet_detector_SSR1_2/S01_AXIS]
connect_bd_intf_net [get_bd_intf_pins packet_detector_SSR1_3/M01_AXIS] [get_bd_intf_pins axis_combiner_0/S07_AXIS]
connect_bd_intf_net [get_bd_intf_pins packet_detector_SSR1_7/M00_AXIS] [get_bd_intf_pins axis_combiner_1/S06_AXIS]
connect_bd_intf_net [get_bd_intf_pins S04_AXIS] [get_bd_intf_pins packet_detector_SSR1_6/S00_AXIS]
connect_bd_intf_net [get_bd_intf_pins packet_detector_SSR1_4/M00_AXIS] [get_bd_intf_pins axis_combiner_1/S00_AXIS]
connect_bd_intf_net [get_bd_intf_pins packet_detector_SSR1_2/M01_AXIS] [get_bd_intf_pins axis_combiner_0/S05_AXIS]
connect_bd_intf_net [get_bd_intf_pins S03_AXIS1] [get_bd_intf_pins packet_detector_SSR1_1/S01_AXIS]
connect_bd_intf_net [get_bd_intf_pins S00_AXI6] [get_bd_intf_pins packet_detector_SSR1_6/S00_AXI]
connect_bd_intf_net [get_bd_intf_pins packet_detector_SSR1_5/M01_AXIS] [get_bd_intf_pins axis_combiner_1/S03_AXIS]
connect_bd_intf_net [get_bd_intf_pins packet_detector_SSR1_5/M00_AXIS] [get_bd_intf_pins axis_combiner_1/S02_AXIS]
connect_bd_intf_net [get_bd_intf_pins M_AXIS1] [get_bd_intf_pins axis_combiner_0/M_AXIS]
connect_bd_intf_net [get_bd_intf_pins S01_AXIS1] [get_bd_intf_pins packet_detector_SSR1_0/S01_AXIS]
connect_bd_intf_net [get_bd_intf_pins S04_AXIS1] [get_bd_intf_pins packet_detector_SSR1_2/S00_AXIS]
connect_bd_intf_net [get_bd_intf_pins S00_AXIS] [get_bd_intf_pins packet_detector_SSR1_4/S00_AXIS]
connect_bd_intf_net [get_bd_intf_pins packet_detector_SSR1_7/M01_AXIS] [get_bd_intf_pins axis_combiner_1/S07_AXIS]
connect_bd_intf_net [get_bd_intf_pins S07_AXIS1] [get_bd_intf_pins packet_detector_SSR1_3/S01_AXIS]
connect_bd_intf_net [get_bd_intf_pins M_AXIS] [get_bd_intf_pins axis_combiner_1/M_AXIS]
connect_bd_intf_net [get_bd_intf_pins S06_AXIS1] [get_bd_intf_pins packet_detector_SSR1_3/S00_AXIS]
connect_bd_intf_net [get_bd_intf_pins packet_detector_SSR1_1/M01_AXIS] [get_bd_intf_pins axis_combiner_0/S03_AXIS]
connect_bd_intf_net [get_bd_intf_pins S07_AXIS] [get_bd_intf_pins packet_detector_SSR1_7/S01_AXIS]
connect_bd_intf_net [get_bd_intf_pins S00_AXI4] [get_bd_intf_pins packet_detector_SSR1_4/S00_AXI]
connect_bd_intf_net [get_bd_intf_pins S00_AXI5] [get_bd_intf_pins packet_detector_SSR1_5/S00_AXI]
connect_bd_intf_net [get_bd_intf_pins S00_AXI2] [get_bd_intf_pins packet_detector_SSR1_2/S00_AXI]
connect_bd_intf_net [get_bd_intf_pins S00_AXIS1] [get_bd_intf_pins packet_detector_SSR1_0/S00_AXIS]
connect_bd_intf_net [get_bd_intf_pins S05_AXIS] [get_bd_intf_pins packet_detector_SSR1_6/S01_AXIS]
connect_bd_intf_net [get_bd_intf_pins packet_detector_SSR1_3/M00_AXIS] [get_bd_intf_pins axis_combiner_0/S06_AXIS]
connect_bd_intf_net [get_bd_intf_pins S00_AXI1] [get_bd_intf_pins packet_detector_SSR1_1/S00_AXI]
connect_bd_intf_net [get_bd_intf_pins S01_AXIS] [get_bd_intf_pins packet_detector_SSR1_4/S01_AXIS]
connect_bd_intf_net [get_bd_intf_pins S00_AXI7] [get_bd_intf_pins packet_detector_SSR1_7/S00_AXI]
connect_bd_intf_net [get_bd_intf_pins packet_detector_SSR1_4/M01_AXIS] [get_bd_intf_pins axis_combiner_1/S01_AXIS]
connect_bd_intf_net [get_bd_intf_pins packet_detector_SSR1_0/M00_AXIS] [get_bd_intf_pins axis_combiner_0/S00_AXIS]
connect_bd_intf_net [get_bd_intf_pins S02_AXIS1] [get_bd_intf_pins packet_detector_SSR1_1/S00_AXIS]
connect_bd_intf_net [get_bd_intf_pins packet_detector_SSR1_2/M00_AXIS] [get_bd_intf_pins axis_combiner_0/S04_AXIS]
connect_bd_net [get_bd_pins aclk] \
  [get_bd_pins axis_combiner_1/aclk] [get_bd_pins axis_combiner_0/aclk] [get_bd_pins packet_detector_SSR1_0/aclk] \
  [get_bd_pins packet_detector_SSR1_1/aclk] [get_bd_pins packet_detector_SSR1_2/aclk] \
  [get_bd_pins packet_detector_SSR1_3/aclk] [get_bd_pins packet_detector_SSR1_4/aclk] \
  [get_bd_pins packet_detector_SSR1_5/aclk] [get_bd_pins packet_detector_SSR1_6/aclk] \
  [get_bd_pins packet_detector_SSR1_7/aclk]
connect_bd_net [get_bd_pins aresetn] \
  [get_bd_pins axis_combiner_1/aresetn] [get_bd_pins axis_combiner_0/aresetn] [get_bd_pins packet_detector_SSR1_0/aresetn] \
  [get_bd_pins packet_detector_SSR1_1/aresetn] [get_bd_pins packet_detector_SSR1_2/aresetn] \
  [get_bd_pins packet_detector_SSR1_3/aresetn] [get_bd_pins packet_detector_SSR1_4/aresetn] \
  [get_bd_pins packet_detector_SSR1_5/aresetn] [get_bd_pins packet_detector_SSR1_6/aresetn] \
  [get_bd_pins packet_detector_SSR1_7/aresetn]
connect_bd_net [get_bd_pins axis_combiner_1/m_axis_tvalid] [get_bd_pins m_axis_tvalid1]
connect_bd_net -net m_axis_tready1_1 [get_bd_pins m_axis_tready1] [get_bd_pins axis_combiner_1/m_axis_tready]
connect_bd_net [get_bd_pins axis_combiner_0/m_axis_tvalid] [get_bd_pins m_axis_tvalid2]
connect_bd_net -net m_axis_tready2_1 [get_bd_pins m_axis_tready2] [get_bd_pins axis_combiner_0/m_axis_tready]
connect_bd_net [get_bd_pins s00_axi_aclk] \
  [get_bd_pins packet_detector_SSR1_0/s00_axi_aclk] [get_bd_pins packet_detector_SSR1_1/s00_axi_aclk] \
  [get_bd_pins packet_detector_SSR1_2/s00_axi_aclk] [get_bd_pins packet_detector_SSR1_3/s00_axi_aclk] \
  [get_bd_pins packet_detector_SSR1_4/s00_axi_aclk] [get_bd_pins packet_detector_SSR1_5/s00_axi_aclk] \
  [get_bd_pins packet_detector_SSR1_6/s00_axi_aclk] [get_bd_pins packet_detector_SSR1_7/s00_axi_aclk]
connect_bd_net [get_bd_pins s00_axi_aresetn] \
  [get_bd_pins packet_detector_SSR1_0/s00_axi_aresetn] [get_bd_pins packet_detector_SSR1_1/s00_axi_aresetn] \
  [get_bd_pins packet_detector_SSR1_2/s00_axi_aresetn] [get_bd_pins packet_detector_SSR1_3/s00_axi_aresetn] \
  [get_bd_pins packet_detector_SSR1_4/s00_axi_aresetn] [get_bd_pins packet_detector_SSR1_5/s00_axi_aresetn] \
  [get_bd_pins packet_detector_SSR1_6/s00_axi_aresetn] [get_bd_pins packet_detector_SSR1_7/s00_axi_aresetn]
connect_bd_net [get_bd_pins packet_detector_SSR1_4/PD_FLAG] [get_bd_pins PD_FLAG]

current_bd_instance /data_width_block
connect_bd_intf_net [get_bd_intf_pins M02_AXIS1] [get_bd_intf_pins axis_broadcaster_1/M02_AXIS]
connect_bd_intf_net [get_bd_intf_pins M00_AXIS] [get_bd_intf_pins axis_broadcaster_0/M00_AXIS]
connect_bd_intf_net [get_bd_intf_pins M03_AXIS1] [get_bd_intf_pins axis_broadcaster_1/M03_AXIS]
connect_bd_intf_net [get_bd_intf_pins M00_AXIS1] [get_bd_intf_pins axis_broadcaster_1/M00_AXIS]
connect_bd_intf_net [get_bd_intf_pins S_AXIS1] [get_bd_intf_pins axis_broadcaster_1/S_AXIS]
connect_bd_intf_net [get_bd_intf_pins M02_AXIS] [get_bd_intf_pins axis_broadcaster_0/M02_AXIS]
connect_bd_intf_net [get_bd_intf_pins M01_AXIS1] [get_bd_intf_pins axis_broadcaster_1/M01_AXIS]
connect_bd_intf_net [get_bd_intf_pins M01_AXIS] [get_bd_intf_pins axis_broadcaster_0/M01_AXIS]
connect_bd_intf_net [get_bd_intf_pins M03_AXIS] [get_bd_intf_pins axis_broadcaster_0/M03_AXIS]
connect_bd_intf_net [get_bd_intf_pins S_AXIS] [get_bd_intf_pins axis_broadcaster_0/S_AXIS]
connect_bd_net [get_bd_pins xlslice_0/Dout] [get_bd_pins Dout]
connect_bd_net [get_bd_pins xlslice_1/Dout] [get_bd_pins Dout1]
connect_bd_net [get_bd_pins xlslice_2/Dout] [get_bd_pins Dout2]
connect_bd_net [get_bd_pins xlslice_3/Dout] [get_bd_pins Dout3]
connect_bd_net [get_bd_pins aclk] [get_bd_pins axis_broadcaster_0/aclk] [get_bd_pins axis_broadcaster_1/aclk]
connect_bd_net [get_bd_pins aresetn] [get_bd_pins axis_broadcaster_0/aresetn] [get_bd_pins axis_broadcaster_1/aresetn]
connect_bd_net [get_bd_pins axis_broadcaster_0/m_axis_tdata] \
  [get_bd_pins xlslice_0/Din] [get_bd_pins xlslice_1/Din] [get_bd_pins xlslice_3/Din] [get_bd_pins xlslice_2/Din]
connect_bd_net [get_bd_pins xlslice_4/Dout] [get_bd_pins Dout4]
connect_bd_net [get_bd_pins axis_broadcaster_1/m_axis_tdata] \
  [get_bd_pins xlslice_4/Din] [get_bd_pins xlslice_5/Din] [get_bd_pins xlslice_6/Din] [get_bd_pins xlslice_7/Din]
connect_bd_net [get_bd_pins xlslice_5/Dout] [get_bd_pins Dout5]
connect_bd_net [get_bd_pins xlslice_6/Dout] [get_bd_pins Dout6]
connect_bd_net [get_bd_pins xlslice_7/Dout] [get_bd_pins Dout7]

current_bd_instance /
connect_bd_intf_net [get_bd_intf_ports sysref_in] [get_bd_intf_pins usp_rf_data_converter_0/sysref_in]
connect_bd_intf_net [get_bd_intf_pins usp_rf_data_converter_0/m02_axis] [get_bd_intf_pins ch_div_block/S02_AXIS]
connect_bd_intf_net [get_bd_intf_ports vout12_0] [get_bd_intf_pins usp_rf_data_converter_0/vout12]
connect_bd_intf_net [get_bd_intf_ports dac1_clk_0] [get_bd_intf_pins usp_rf_data_converter_0/dac1_clk]
connect_bd_intf_net [get_bd_intf_ports vin1_01_0] [get_bd_intf_pins usp_rf_data_converter_0/vin1_01]
connect_bd_intf_net [get_bd_intf_pins dac_dma_block/M_AXI_MM2S] [get_bd_intf_pins ddr_block/S_AXI]
connect_bd_intf_net [get_bd_intf_pins usp_rf_data_converter_0/s03_axis] [get_bd_intf_pins data_width_block/M03_AXIS1]
connect_bd_intf_net [get_bd_intf_pins usp_rf_data_converter_0/m31_axis] [get_bd_intf_pins ch_div_block/S05_AXIS1]
connect_bd_intf_net [get_bd_intf_pins usp_rf_data_converter_0/s01_axis] [get_bd_intf_pins data_width_block/M01_AXIS1]
connect_bd_intf_net [get_bd_intf_pins axi_interconnect_2/M13_AXI] [get_bd_intf_pins adc_tile0/S00_AXI]
connect_bd_intf_net [get_bd_intf_ports vout03_0] [get_bd_intf_pins usp_rf_data_converter_0/vout03]
connect_bd_intf_net [get_bd_intf_ports adc0_clk_0] [get_bd_intf_pins usp_rf_data_converter_0/adc0_clk]
connect_bd_intf_net [get_bd_intf_pins zynq_ultra_ps_e_0/M_AXI_HPM0_FPD] [get_bd_intf_pins ddr_block/HPM0_AXI]
connect_bd_intf_net [get_bd_intf_pins axi_interconnect_2/M04_AXI] [get_bd_intf_pins dac_block0_tile1/S00_AXI]
connect_bd_intf_net [get_bd_intf_ports vin2_01_0] [get_bd_intf_pins usp_rf_data_converter_0/vin2_01]
connect_bd_intf_net [get_bd_intf_pins usp_rf_data_converter_0/m30_axis] [get_bd_intf_pins ch_div_block/S04_AXIS1]
connect_bd_intf_net [get_bd_intf_ports vin1_23_0] [get_bd_intf_pins usp_rf_data_converter_0/vin1_23]
connect_bd_intf_net [get_bd_intf_pins adc_tile0/S01_AXIS] [get_bd_intf_pins ch_div_block/M_AXIS1]
connect_bd_intf_net [get_bd_intf_pins usp_rf_data_converter_0/s11_axis] [get_bd_intf_pins data_width_block/M01_AXIS]
connect_bd_intf_net [get_bd_intf_ports vin2_23_0] [get_bd_intf_pins usp_rf_data_converter_0/vin2_23]
connect_bd_intf_net [get_bd_intf_pins usp_rf_data_converter_0/s00_axis] [get_bd_intf_pins data_width_block/M00_AXIS1]
connect_bd_intf_net [get_bd_intf_ports vout11_0] [get_bd_intf_pins usp_rf_data_converter_0/vout11]
connect_bd_intf_net [get_bd_intf_pins usp_rf_data_converter_0/m22_axis] [get_bd_intf_pins ch_div_block/S02_AXIS1]
connect_bd_intf_net [get_bd_intf_pins axi_interconnect_2/M12_AXI] [get_bd_intf_pins ch_div_block/S00_AXI7]
connect_bd_intf_net [get_bd_intf_pins ddr_writer_0/M00_AXI] [get_bd_intf_pins ddr_block/S00_AXI]
connect_bd_intf_net [get_bd_intf_pins adc_tile0/SLOT_0_AXIS] [get_bd_intf_pins ddr_writer_0/S00_AXIS]
connect_bd_intf_net [get_bd_intf_pins usp_rf_data_converter_0/s_axi] [get_bd_intf_pins axi_interconnect_2/M01_AXI]
connect_bd_intf_net [get_bd_intf_pins usp_rf_data_converter_0/s12_axis] [get_bd_intf_pins data_width_block/M02_AXIS]
connect_bd_intf_net [get_bd_intf_pins axi_interconnect_2/M10_AXI] [get_bd_intf_pins ch_div_block/S00_AXI5]
connect_bd_intf_net [get_bd_intf_pins axi_interconnect_2/M06_AXI] [get_bd_intf_pins ch_div_block/S00_AXI1]
connect_bd_intf_net [get_bd_intf_pins axi_interconnect_2/M05_AXI] [get_bd_intf_pins ch_div_block/S00_AXI]
connect_bd_intf_net [get_bd_intf_pins usp_rf_data_converter_0/m33_axis] [get_bd_intf_pins ch_div_block/S07_AXIS1]
connect_bd_intf_net [get_bd_intf_pins usp_rf_data_converter_0/m12_axis] [get_bd_intf_pins ch_div_block/S06_AXIS]
connect_bd_intf_net [get_bd_intf_ports vout01_0] [get_bd_intf_pins usp_rf_data_converter_0/vout01]
connect_bd_intf_net [get_bd_intf_pins axi_interconnect_2/S00_AXI] [get_bd_intf_pins zynq_ultra_ps_e_0/M_AXI_HPM1_FPD]
connect_bd_intf_net [get_bd_intf_ports adc3_clk_0] [get_bd_intf_pins usp_rf_data_converter_0/adc3_clk]
connect_bd_intf_net [get_bd_intf_pins usp_rf_data_converter_0/m20_axis] [get_bd_intf_pins ch_div_block/S00_AXIS1]
connect_bd_intf_net [get_bd_intf_pins usp_rf_data_converter_0/m00_axis] [get_bd_intf_pins ch_div_block/S00_AXIS]
connect_bd_intf_net [get_bd_intf_pins adc_tile0/S00_AXIS] [get_bd_intf_pins ch_div_block/M_AXIS]
connect_bd_intf_net [get_bd_intf_pins axi_interconnect_2/M08_AXI] [get_bd_intf_pins ch_div_block/S00_AXI3]
connect_bd_intf_net [get_bd_intf_ports CLK_DIFF_SYSREF_CLK] [get_bd_intf_pins MTS_Block/CLK_DIFF_SYSREF_CLK]
connect_bd_intf_net [get_bd_intf_pins usp_rf_data_converter_0/m03_axis] [get_bd_intf_pins ch_div_block/S03_AXIS]
connect_bd_intf_net [get_bd_intf_pins dac_block1_tile1/SLOT_0_AXIS] [get_bd_intf_pins data_width_block/S_AXIS]
connect_bd_intf_net [get_bd_intf_pins dac_block0_tile1/S_AXIS] [get_bd_intf_pins dac_dma_block/M00_AXIS]
connect_bd_intf_net [get_bd_intf_pins axi_interconnect_2/M07_AXI] [get_bd_intf_pins ch_div_block/S00_AXI2]
connect_bd_intf_net [get_bd_intf_pins usp_rf_data_converter_0/s10_axis] [get_bd_intf_pins data_width_block/M00_AXIS]
connect_bd_intf_net [get_bd_intf_pins usp_rf_data_converter_0/m13_axis] [get_bd_intf_pins ch_div_block/S07_AXIS]
connect_bd_intf_net [get_bd_intf_pins usp_rf_data_converter_0/m21_axis] [get_bd_intf_pins ch_div_block/S01_AXIS1]
connect_bd_intf_net [get_bd_intf_ports vout00_0] [get_bd_intf_pins usp_rf_data_converter_0/vout00]
connect_bd_intf_net [get_bd_intf_ports vin3_23_0] [get_bd_intf_pins usp_rf_data_converter_0/vin3_23]
connect_bd_intf_net [get_bd_intf_pins usp_rf_data_converter_0/m10_axis] [get_bd_intf_pins ch_div_block/S04_AXIS]
connect_bd_intf_net [get_bd_intf_pins dac_block0_tile1/SLOT_0_AXIS] [get_bd_intf_pins data_width_block/S_AXIS1]
connect_bd_intf_net [get_bd_intf_pins axi_interconnect_2/M02_AXI] [get_bd_intf_pins ddr_writer_0/S00_AXI]
connect_bd_intf_net [get_bd_intf_pins dac_block1_tile1/S_AXIS] [get_bd_intf_pins dac_dma_block/M01_AXIS]
connect_bd_intf_net [get_bd_intf_ports vout13_0] [get_bd_intf_pins usp_rf_data_converter_0/vout13]
connect_bd_intf_net [get_bd_intf_ports vout10_0] [get_bd_intf_pins usp_rf_data_converter_0/vout10]
connect_bd_intf_net [get_bd_intf_pins axi_interconnect_2/M09_AXI] [get_bd_intf_pins ch_div_block/S00_AXI4]
connect_bd_intf_net [get_bd_intf_pins axi_interconnect_2/M03_AXI] [get_bd_intf_pins dac_block1_tile1/S00_AXI]
connect_bd_intf_net [get_bd_intf_pins usp_rf_data_converter_0/m01_axis] [get_bd_intf_pins ch_div_block/S01_AXIS]
connect_bd_intf_net [get_bd_intf_ports vin0_23_0] [get_bd_intf_pins usp_rf_data_converter_0/vin0_23]
connect_bd_intf_net [get_bd_intf_ports vin0_01_0] [get_bd_intf_pins usp_rf_data_converter_0/vin0_01]
connect_bd_intf_net [get_bd_intf_pins usp_rf_data_converter_0/m11_axis] [get_bd_intf_pins ch_div_block/S05_AXIS]
connect_bd_intf_net [get_bd_intf_ports adc2_clk_0] [get_bd_intf_pins usp_rf_data_converter_0/adc2_clk]
connect_bd_intf_net [get_bd_intf_ports vin3_01_0] [get_bd_intf_pins usp_rf_data_converter_0/vin3_01]
connect_bd_intf_net [get_bd_intf_pins usp_rf_data_converter_0/s13_axis] [get_bd_intf_pins data_width_block/M03_AXIS]
connect_bd_intf_net [get_bd_intf_ports vout02_0] [get_bd_intf_pins usp_rf_data_converter_0/vout02]
connect_bd_intf_net [get_bd_intf_pins dac_dma_block/S_AXI_LITE] [get_bd_intf_pins axi_interconnect_2/M00_AXI]
connect_bd_intf_net [get_bd_intf_ports dac0_clk] [get_bd_intf_pins usp_rf_data_converter_0/dac0_clk]
connect_bd_intf_net [get_bd_intf_ports ddr4_sdram] [get_bd_intf_pins ddr_block/ddr4_sdram]
connect_bd_intf_net [get_bd_intf_pins axi_interconnect_2/M11_AXI] [get_bd_intf_pins ch_div_block/S00_AXI6]
connect_bd_intf_net [get_bd_intf_pins usp_rf_data_converter_0/s02_axis] [get_bd_intf_pins data_width_block/M02_AXIS1]
connect_bd_intf_net [get_bd_intf_ports adc1_clk_0] [get_bd_intf_pins usp_rf_data_converter_0/adc1_clk]
connect_bd_intf_net [get_bd_intf_ports CLK_DIFF_PL_CLK] [get_bd_intf_pins MTS_Block/CLK_DIFF_PL_CLK]
connect_bd_intf_net [get_bd_intf_pins usp_rf_data_converter_0/m23_axis] [get_bd_intf_pins ch_div_block/S03_AXIS1]
connect_bd_intf_net [get_bd_intf_pins usp_rf_data_converter_0/m32_axis] [get_bd_intf_pins ch_div_block/S06_AXIS1]
connect_bd_intf_net [get_bd_intf_ports user_si570_sysclk] [get_bd_intf_pins ddr_block/user_si570_sysclk]
